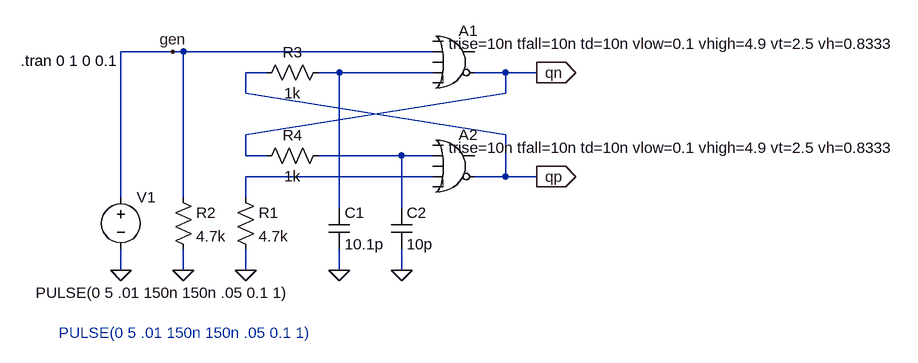
[diagram p0: schematic NorLatch.asc]
NorLatch.asc, the LTspice schematic file:
Version 4
SHEET 1 1188 1044
WIRE 16 144 16 176
WIRE 16 176 416 240
WIRE 416 240 416 304
WIRE 416 176 16 240
WIRE 16 240 16 272
WIRE 16 272 48 272
WIRE -80 416 -80 448
WIRE 16 416 16 448
WIRE -176 416 -176 448
WIRE -176 336 -176 112
WIRE 368 144 416 144
WIRE 416 144 416 176
WIRE 304 144 160 144
WIRE 368 304 416 304
WIRE -96 112 -176 112
WIRE 416 144 464 144
WIRE 416 304 464 304
WIRE 304 304 16 304
WIRE 16 304 16 336
WIRE 304 112 -80 112
WIRE -80 112 -80 336
WIRE -80 112 -96 112
WIRE 48 144 16 144
WIRE 128 272 256 272
WIRE 160 416 160 448
WIRE 256 416 256 448
WIRE 160 352 160 144
WIRE 160 144 128 144
WIRE 256 352 256 272
WIRE 256 272 304 272
FLAG -80 448 0
FLAG 16 448 0
FLAG -176 448 0
FLAG -96 112 gen
FLAG 464 144 qn
IOPIN 464 144 Out
FLAG 464 304 qp
IOPIN 464 304 Out
FLAG 160 448 0
FLAG 256 448 0
SYMBOL res 0 320 R0
SYMATTR InstName R1
SYMATTR Value 4.7k
SYMBOL res -96 320 R0
SYMATTR InstName R2
SYMATTR Value 4.7k
SYMBOL voltage -176 320 R0
WINDOW 3 -131 163 Left 0
WINDOW 123 0 0 Left 0
WINDOW 39 0 0 Left 0
SYMATTR Value PULSE(0 5 .01 150n 150n .05 0.1 1)
SYMATTR InstName V1
SYMBOL Digital\\or 336 64 R0
WINDOW 3 -8 36 Left 0
SYMATTR Value trise=10n tfall=10n td=10n vlow=0.1 vhigh=4.9 vt=2.5 vh=0.8333
SYMATTR InstName A1
SYMBOL Digital\\or 336 224 R0
WINDOW 3 -8 36 Left 0
SYMATTR Value trise=10n tfall=10n td=10n vlow=0.1 vhigh=4.9 vt=2.5 vh=0.8333
SYMATTR InstName A2
SYMBOL res 32 160 R270
WINDOW 0 32 56 VTop 0
WINDOW 3 0 56 VBottom 0
SYMATTR InstName R3
SYMATTR Value 1k
SYMBOL res 32 288 R270
WINDOW 0 32 56 VTop 0
WINDOW 3 0 56 VBottom 0
SYMATTR InstName R4
SYMATTR Value 1k
SYMBOL cap 144 352 R0
SYMATTR InstName C1
SYMATTR Value 10.1p
SYMBOL cap 240 352 R0
SYMATTR InstName C2
SYMATTR Value 10p
TEXT -330 126 Left 0 !.tran 0 1 0 0.1
TEXT -272 544 Left 0 ;PULSE(0 5 .01 150n 150n .05 0.1 1)

The netlist it stands for:
* NorLatch.asc
R1 N002 0 4.7k
R2 gen 0 4.7k
V1 gen 0 PULSE(0 5 .01 150n 150n .05 0.1 1)
A1 0 gen 0 N001 0 qn 0 0 OR trise=10n tfall=10n td=10n vlow=0.1 vhigh=4.9 vt=2.5 vh=0.8333
A2 0 N003 0 N002 0 qp 0 0 OR trise=10n tfall=10n td=10n vlow=0.1 vhigh=4.9 vt=2.5 vh=0.8333
R3 qp N001 1k
R4 qn N003 1k
C1 N001 0 10.1p
C2 N003 0 10p
.tran 0 1 0 0.1
* PULSE(0 5 .01 150n 150n .05 0.1 1)
.backanno
.end